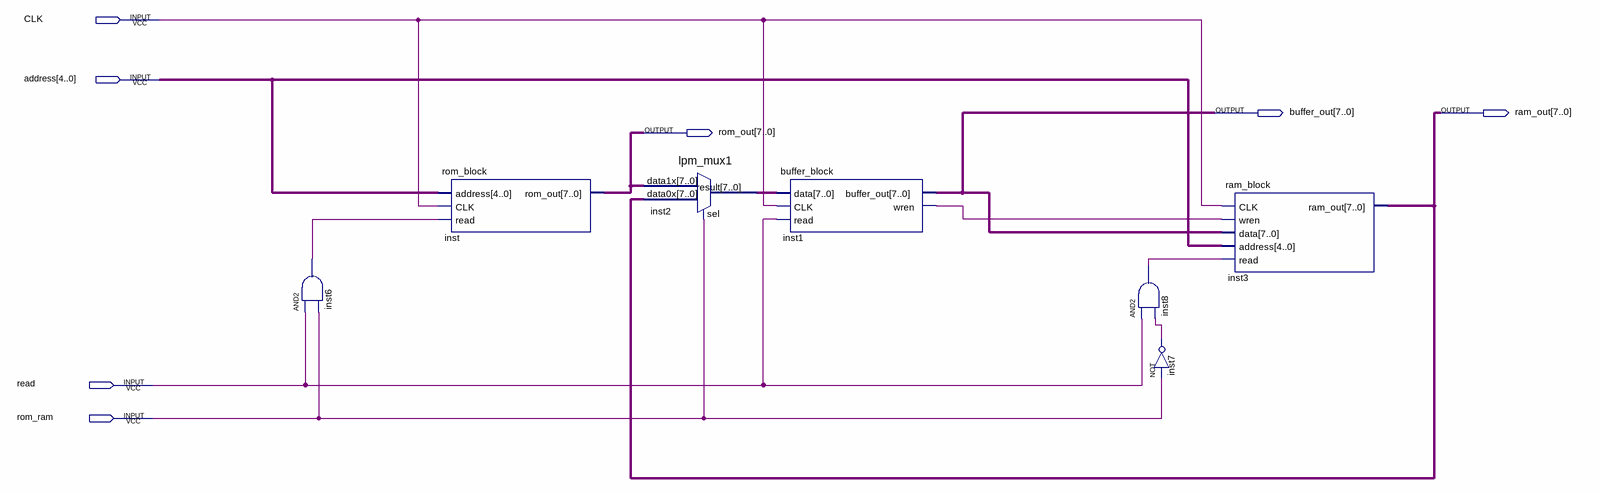
[diagram p0: schematic sheet]
// Quartus schematic main.bdf as structural Verilog: 7 symbols, 7 pins
module main (
  input  CLK,
  input  [4:0] address,
  input  read,
  input  rom_ram,
  output [7:0] buffer_out,
  output [7:0] ram_out,
  output [7:0] rom_out
);

  wire inst1_wren, inst6_out, inst7_out, inst8_out;
  wire [7:0] inst2_result;

  and inst6 (inst6_out, read, rom_ram);
  rom_block inst (.address(address), .CLK(CLK), .read(inst6_out), .rom_out(rom_out));
  lpm_mux1 inst2 (.data1x(rom_out), .data0x(ram_out), .sel(rom_ram), .result(inst2_result));
  buffer_block inst1 (.data(inst2_result), .CLK(CLK), .read(read), .buffer_out(buffer_out), .wren(inst1_wren));
  and inst8 (inst8_out, read, inst7_out);
  not inst7 (inst7_out, rom_ram);
  ram_block inst3 (
    .CLK(CLK), .wren(inst1_wren), .data(buffer_out), .address(address), .read(inst8_out), .ram_out(ram_out));
endmodule
